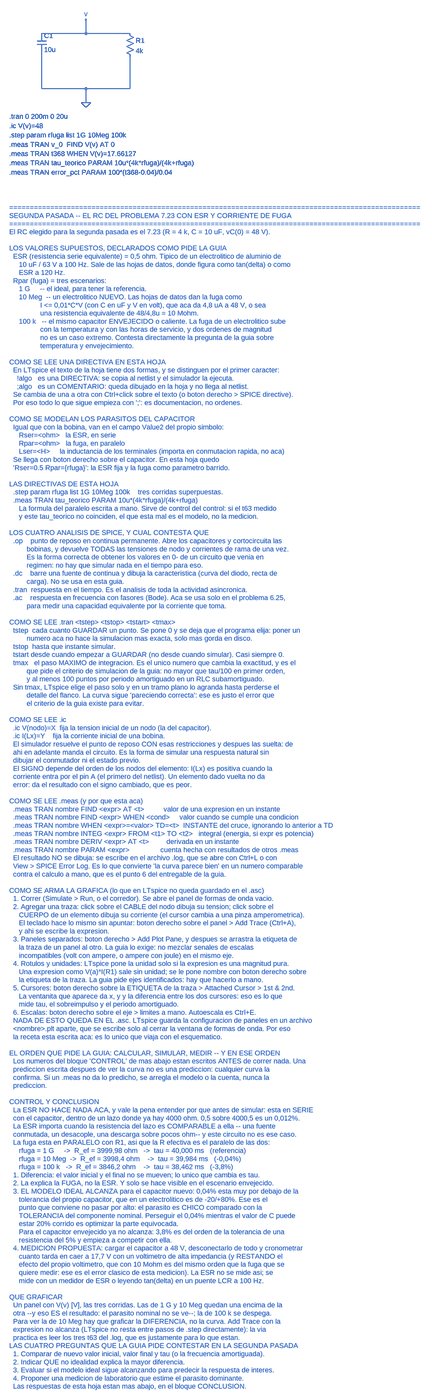
[diagram p0: schematic X2_no_ideal_RC_con_fuga.asc, whole sheet]
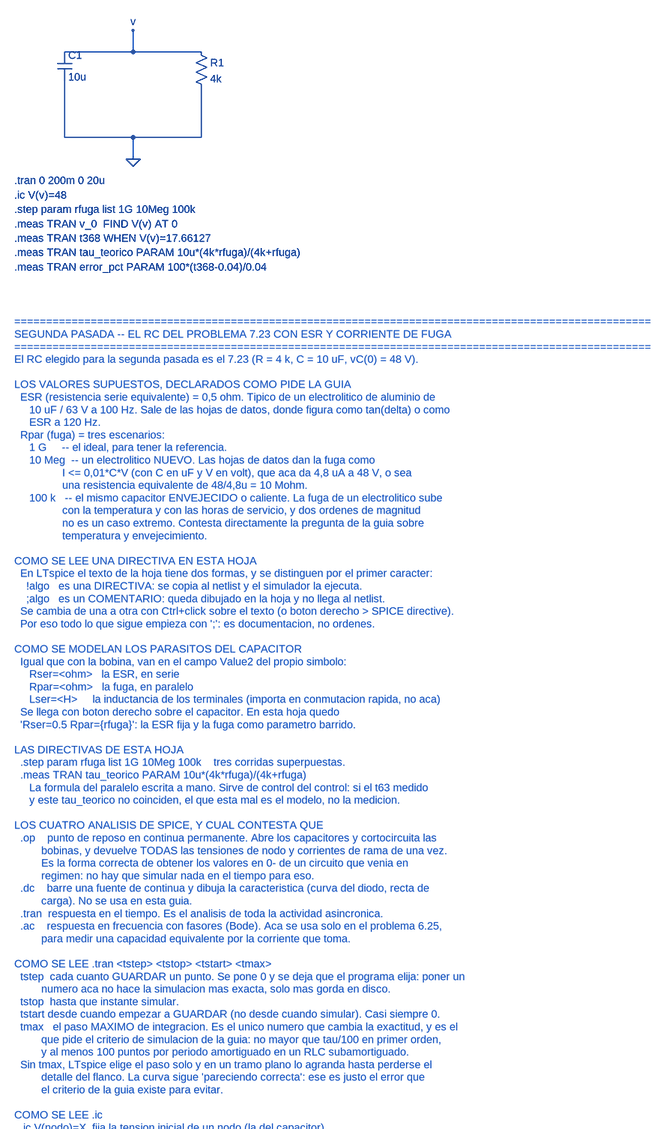
[diagram p1: schematic X2_no_ideal_RC_con_fuga.asc, part, row 1 of 2, column 1 of 1]
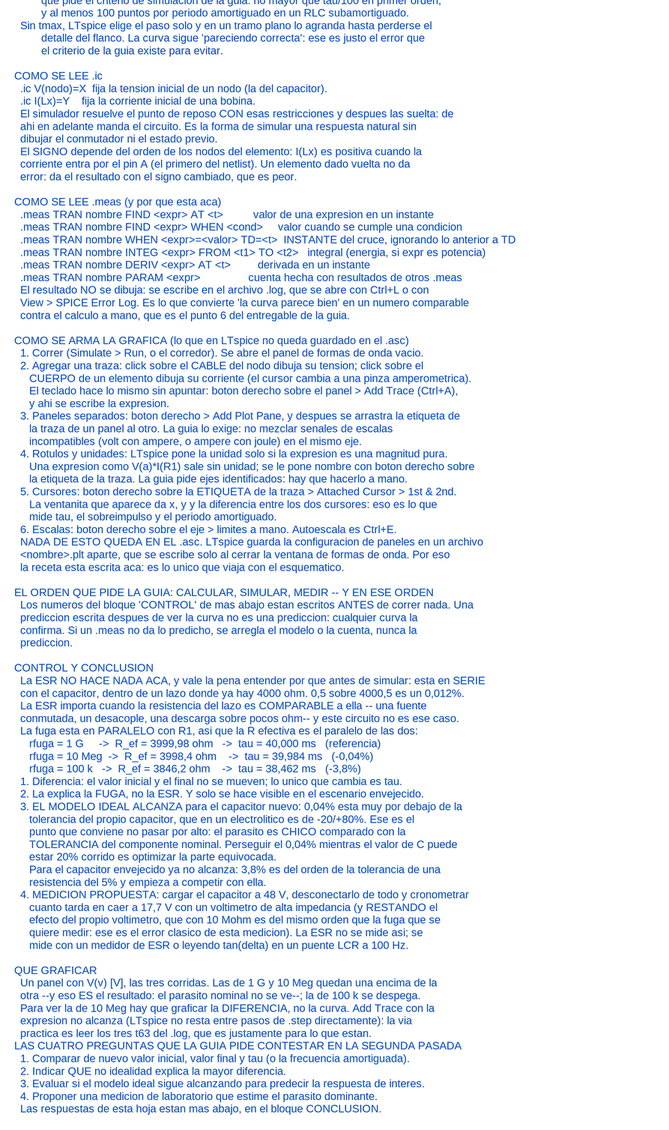
[diagram p2: schematic X2_no_ideal_RC_con_fuga.asc, part, row 2 of 2, column 1 of 1]
X2_no_ideal_RC_con_fuga.asc, the LTspice schematic file:
Version 4
SHEET 1 2200 2800
WIRE 176 176 176 304
WIRE 480 192 480 304
WIRE 176 112 480 112
WIRE 176 304 480 304
WIRE 328 304 328 352
WIRE 328 112 328 64
FLAG 328 352 0
FLAG 328 64 v
SYMBOL cap 160 112 R0
SYMATTR InstName C1
SYMATTR Value 10u
SYMATTR Value2 Rser=0.5 Rpar={rfuga}
SYMBOL res 464 96 R0
SYMATTR InstName R1
SYMATTR Value 4k
TEXT 64 400 Left 2 !.tran 0 200m 0 20u
TEXT 64 432 Left 2 !.ic V(v)=48
TEXT 64 464 Left 2 !.step param rfuga list 1G 10Meg 100k
TEXT 64 496 Left 2 !.meas TRAN v_0  FIND V(v) AT 0
TEXT 64 528 Left 2 !.meas TRAN t368 WHEN V(v)=17.66127
TEXT 64 560 Left 2 !.meas TRAN tau_teorico PARAM 10u*(4k*rfuga)/(4k+rfuga)
TEXT 64 592 Left 2 !.meas TRAN error_pct PARAM 100*(t368-0.04)/0.04
TEXT 64 900 Left 2 ;====================================================================================================
TEXT 64 928 Left 2 ;SEGUNDA PASADA -- EL RC DEL PROBLEMA 7.23 CON ESR Y CORRIENTE DE FUGA
TEXT 64 956 Left 2 ;====================================================================================================
TEXT 64 984 Left 2 ;El RC elegido para la segunda pasada es el 7.23 (R = 4 k, C = 10 uF, vC(0) = 48 V).
TEXT 64 1012 Left 2 ;
TEXT 64 1040 Left 2 ;LOS VALORES SUPUESTOS, DECLARADOS COMO PIDE LA GUIA
TEXT 64 1068 Left 2 ;  ESR (resistencia serie equivalente) = 0,5 ohm. Tipico de un electrolitico de aluminio de
TEXT 64 1096 Left 2 ;     10 uF / 63 V a 100 Hz. Sale de las hojas de datos, donde figura como tan(delta) o como
TEXT 64 1124 Left 2 ;     ESR a 120 Hz.
TEXT 64 1152 Left 2 ;  Rpar (fuga) = tres escenarios:
TEXT 64 1180 Left 2 ;     1 G     -- el ideal, para tener la referencia.
TEXT 64 1208 Left 2 ;     10 Meg  -- un electrolitico NUEVO. Las hojas de datos dan la fuga como
TEXT 64 1236 Left 2 ;                I <= 0,01*C*V (con C en uF y V en volt), que aca da 4,8 uA a 48 V, o sea
TEXT 64 1264 Left 2 ;                una resistencia equivalente de 48/4,8u = 10 Mohm.
TEXT 64 1292 Left 2 ;     100 k   -- el mismo capacitor ENVEJECIDO o caliente. La fuga de un electrolitico sube
TEXT 64 1320 Left 2 ;                con la temperatura y con las horas de servicio, y dos ordenes de magnitud
TEXT 64 1348 Left 2 ;                no es un caso extremo. Contesta directamente la pregunta de la guia sobre
TEXT 64 1376 Left 2 ;                temperatura y envejecimiento.
TEXT 64 1404 Left 2 ;
TEXT 64 1432 Left 2 ;COMO SE LEE UNA DIRECTIVA EN ESTA HOJA
TEXT 64 1460 Left 2 ;  En LTspice el texto de la hoja tiene dos formas, y se distinguen por el primer caracter:
TEXT 64 1488 Left 2 ;    !algo   es una DIRECTIVA: se copia al netlist y el simulador la ejecuta.
TEXT 64 1516 Left 2 ;    ;algo   es un COMENTARIO: queda dibujado en la hoja y no llega al netlist.
TEXT 64 1544 Left 2 ;  Se cambia de una a otra con Ctrl+click sobre el texto (o boton derecho > SPICE directive).
TEXT 64 1572 Left 2 ;  Por eso todo lo que sigue empieza con ';': es documentacion, no ordenes.
TEXT 64 1600 Left 2 ;
TEXT 64 1628 Left 2 ;COMO SE MODELAN LOS PARASITOS DEL CAPACITOR
TEXT 64 1656 Left 2 ;  Igual que con la bobina, van en el campo Value2 del propio simbolo:
TEXT 64 1684 Left 2 ;     Rser=<ohm>   la ESR, en serie
TEXT 64 1712 Left 2 ;     Rpar=<ohm>   la fuga, en paralelo
TEXT 64 1740 Left 2 ;     Lser=<H>     la inductancia de los terminales (importa en conmutacion rapida, no aca)
TEXT 64 1768 Left 2 ;  Se llega con boton derecho sobre el capacitor. En esta hoja quedo
TEXT 64 1796 Left 2 ;  'Rser=0.5 Rpar={rfuga}': la ESR fija y la fuga como parametro barrido.
TEXT 64 1824 Left 2 ;
TEXT 64 1852 Left 2 ;LAS DIRECTIVAS DE ESTA HOJA
TEXT 64 1880 Left 2 ;  .step param rfuga list 1G 10Meg 100k    tres corridas superpuestas.
TEXT 64 1908 Left 2 ;  .meas TRAN tau_teorico PARAM 10u*(4k*rfuga)/(4k+rfuga)
TEXT 64 1936 Left 2 ;     La formula del paralelo escrita a mano. Sirve de control del control: si el t63 medido
TEXT 64 1964 Left 2 ;     y este tau_teorico no coinciden, el que esta mal es el modelo, no la medicion.
TEXT 64 1992 Left 2 ;
TEXT 64 2020 Left 2 ;LOS CUATRO ANALISIS DE SPICE, Y CUAL CONTESTA QUE
TEXT 64 2048 Left 2 ;  .op    punto de reposo en continua permanente. Abre los capacitores y cortocircuita las
TEXT 64 2076 Left 2 ;         bobinas, y devuelve TODAS las tensiones de nodo y corrientes de rama de una vez.
TEXT 64 2104 Left 2 ;         Es la forma correcta de obtener los valores en 0- de un circuito que venia en
TEXT 64 2132 Left 2 ;         regimen: no hay que simular nada en el tiempo para eso.
TEXT 64 2160 Left 2 ;  .dc    barre una fuente de continua y dibuja la caracteristica (curva del diodo, recta de
TEXT 64 2188 Left 2 ;         carga). No se usa en esta guia.
TEXT 64 2216 Left 2 ;  .tran  respuesta en el tiempo. Es el analisis de toda la actividad asincronica.
TEXT 64 2244 Left 2 ;  .ac    respuesta en frecuencia con fasores (Bode). Aca se usa solo en el problema 6.25,
TEXT 64 2272 Left 2 ;         para medir una capacidad equivalente por la corriente que toma.
TEXT 64 2300 Left 2 ;
TEXT 64 2328 Left 2 ;COMO SE LEE .tran <tstep> <tstop> <tstart> <tmax>
TEXT 64 2356 Left 2 ;  tstep  cada cuanto GUARDAR un punto. Se pone 0 y se deja que el programa elija: poner un
TEXT 64 2384 Left 2 ;         numero aca no hace la simulacion mas exacta, solo mas gorda en disco.
TEXT 64 2412 Left 2 ;  tstop  hasta que instante simular.
TEXT 64 2440 Left 2 ;  tstart desde cuando empezar a GUARDAR (no desde cuando simular). Casi siempre 0.
TEXT 64 2468 Left 2 ;  tmax   el paso MAXIMO de integracion. Es el unico numero que cambia la exactitud, y es el
TEXT 64 2496 Left 2 ;         que pide el criterio de simulacion de la guia: no mayor que tau/100 en primer orden,
TEXT 64 2524 Left 2 ;         y al menos 100 puntos por periodo amortiguado en un RLC subamortiguado.
TEXT 64 2552 Left 2 ;  Sin tmax, LTspice elige el paso solo y en un tramo plano lo agranda hasta perderse el
TEXT 64 2580 Left 2 ;         detalle del flanco. La curva sigue 'pareciendo correcta': ese es justo el error que
TEXT 64 2608 Left 2 ;         el criterio de la guia existe para evitar.
TEXT 64 2636 Left 2 ;
TEXT 64 2664 Left 2 ;COMO SE LEE .ic
TEXT 64 2692 Left 2 ;  .ic V(nodo)=X  fija la tension inicial de un nodo (la del capacitor).
TEXT 64 2720 Left 2 ;  .ic I(Lx)=Y    fija la corriente inicial de una bobina.
TEXT 64 2748 Left 2 ;  El simulador resuelve el punto de reposo CON esas restricciones y despues las suelta: de
TEXT 64 2776 Left 2 ;  ahi en adelante manda el circuito. Es la forma de simular una respuesta natural sin
TEXT 64 2804 Left 2 ;  dibujar el conmutador ni el estado previo.
TEXT 64 2832 Left 2 ;  El SIGNO depende del orden de los nodos del elemento: I(Lx) es positiva cuando la
TEXT 64 2860 Left 2 ;  corriente entra por el pin A (el primero del netlist). Un elemento dado vuelta no da
TEXT 64 2888 Left 2 ;  error: da el resultado con el signo cambiado, que es peor.
TEXT 64 2916 Left 2 ;
TEXT 64 2944 Left 2 ;COMO SE LEE .meas (y por que esta aca)
TEXT 64 2972 Left 2 ;  .meas TRAN nombre FIND <expr> AT <t>          valor de una expresion en un instante
TEXT 64 3000 Left 2 ;  .meas TRAN nombre FIND <expr> WHEN <cond>     valor cuando se cumple una condicion
TEXT 64 3028 Left 2 ;  .meas TRAN nombre WHEN <expr>=<valor> TD=<t>  INSTANTE del cruce, ignorando lo anterior a TD
TEXT 64 3056 Left 2 ;  .meas TRAN nombre INTEG <expr> FROM <t1> TO <t2>   integral (energia, si expr es potencia)
TEXT 64 3084 Left 2 ;  .meas TRAN nombre DERIV <expr> AT <t>         derivada en un instante
TEXT 64 3112 Left 2 ;  .meas TRAN nombre PARAM <expr>                cuenta hecha con resultados de otros .meas
TEXT 64 3140 Left 2 ;  El resultado NO se dibuja: se escribe en el archivo .log, que se abre con Ctrl+L o con
TEXT 64 3168 Left 2 ;  View > SPICE Error Log. Es lo que convierte 'la curva parece bien' en un numero comparable
TEXT 64 3196 Left 2 ;  contra el calculo a mano, que es el punto 6 del entregable de la guia.
TEXT 64 3224 Left 2 ;
TEXT 64 3252 Left 2 ;COMO SE ARMA LA GRAFICA (lo que en LTspice no queda guardado en el .asc)
TEXT 64 3280 Left 2 ;  1. Correr (Simulate > Run, o el corredor). Se abre el panel de formas de onda vacio.
TEXT 64 3308 Left 2 ;  2. Agregar una traza: click sobre el CABLE del nodo dibuja su tension; click sobre el
TEXT 64 3336 Left 2 ;     CUERPO de un elemento dibuja su corriente (el cursor cambia a una pinza amperometrica).
TEXT 64 3364 Left 2 ;     El teclado hace lo mismo sin apuntar: boton derecho sobre el panel > Add Trace (Ctrl+A),
TEXT 64 3392 Left 2 ;     y ahi se escribe la expresion.
TEXT 64 3420 Left 2 ;  3. Paneles separados: boton derecho > Add Plot Pane, y despues se arrastra la etiqueta de
TEXT 64 3448 Left 2 ;     la traza de un panel al otro. La guia lo exige: no mezclar senales de escalas
TEXT 64 3476 Left 2 ;     incompatibles (volt con ampere, o ampere con joule) en el mismo eje.
TEXT 64 3504 Left 2 ;  4. Rotulos y unidades: LTspice pone la unidad solo si la expresion es una magnitud pura.
TEXT 64 3532 Left 2 ;     Una expresion como V(a)*I(R1) sale sin unidad; se le pone nombre con boton derecho sobre
TEXT 64 3560 Left 2 ;     la etiqueta de la traza. La guia pide ejes identificados: hay que hacerlo a mano.
TEXT 64 3588 Left 2 ;  5. Cursores: boton derecho sobre la ETIQUETA de la traza > Attached Cursor > 1st & 2nd.
TEXT 64 3616 Left 2 ;     La ventanita que aparece da x, y y la diferencia entre los dos cursores: eso es lo que
TEXT 64 3644 Left 2 ;     mide tau, el sobreimpulso y el periodo amortiguado.
TEXT 64 3672 Left 2 ;  6. Escalas: boton derecho sobre el eje > limites a mano. Autoescala es Ctrl+E.
TEXT 64 3700 Left 2 ;  NADA DE ESTO QUEDA EN EL .asc. LTspice guarda la configuracion de paneles en un archivo
TEXT 64 3728 Left 2 ;  <nombre>.plt aparte, que se escribe solo al cerrar la ventana de formas de onda. Por eso
TEXT 64 3756 Left 2 ;  la receta esta escrita aca: es lo unico que viaja con el esquematico.
TEXT 64 3784 Left 2 ;
TEXT 64 3812 Left 2 ;EL ORDEN QUE PIDE LA GUIA: CALCULAR, SIMULAR, MEDIR -- Y EN ESE ORDEN
TEXT 64 3840 Left 2 ;  Los numeros del bloque 'CONTROL' de mas abajo estan escritos ANTES de correr nada. Una
TEXT 64 3868 Left 2 ;  prediccion escrita despues de ver la curva no es una prediccion: cualquier curva la
TEXT 64 3896 Left 2 ;  confirma. Si un .meas no da lo predicho, se arregla el modelo o la cuenta, nunca la
TEXT 64 3924 Left 2 ;  prediccion.
TEXT 64 3952 Left 2 ;
TEXT 64 3980 Left 2 ;CONTROL Y CONCLUSION
TEXT 64 4008 Left 2 ;  La ESR NO HACE NADA ACA, y vale la pena entender por que antes de simular: esta en SERIE
TEXT 64 4036 Left 2 ;  con el capacitor, dentro de un lazo donde ya hay 4000 ohm. 0,5 sobre 4000,5 es un 0,012%.
TEXT 64 4064 Left 2 ;  La ESR importa cuando la resistencia del lazo es COMPARABLE a ella -- una fuente
TEXT 64 4092 Left 2 ;  conmutada, un desacople, una descarga sobre pocos ohm-- y este circuito no es ese caso.
TEXT 64 4120 Left 2 ;  La fuga esta en PARALELO con R1, asi que la R efectiva es el paralelo de las dos:
TEXT 64 4148 Left 2 ;     rfuga = 1 G     ->  R_ef = 3999,98 ohm   ->  tau = 40,000 ms   (referencia)
TEXT 64 4176 Left 2 ;     rfuga = 10 Meg  ->  R_ef = 3998,4 ohm    ->  tau = 39,984 ms   (-0,04%)
TEXT 64 4204 Left 2 ;     rfuga = 100 k   ->  R_ef = 3846,2 ohm    ->  tau = 38,462 ms   (-3,8%)
TEXT 64 4232 Left 2 ;  1. Diferencia: el valor inicial y el final no se mueven; lo unico que cambia es tau.
TEXT 64 4260 Left 2 ;  2. La explica la FUGA, no la ESR. Y solo se hace visible en el escenario envejecido.
TEXT 64 4288 Left 2 ;  3. EL MODELO IDEAL ALCANZA para el capacitor nuevo: 0,04% esta muy por debajo de la
TEXT 64 4316 Left 2 ;     tolerancia del propio capacitor, que en un electrolitico es de -20/+80%. Ese es el
TEXT 64 4344 Left 2 ;     punto que conviene no pasar por alto: el parasito es CHICO comparado con la
TEXT 64 4372 Left 2 ;     TOLERANCIA del componente nominal. Perseguir el 0,04% mientras el valor de C puede
TEXT 64 4400 Left 2 ;     estar 20% corrido es optimizar la parte equivocada.
TEXT 64 4428 Left 2 ;     Para el capacitor envejecido ya no alcanza: 3,8% es del orden de la tolerancia de una
TEXT 64 4456 Left 2 ;     resistencia del 5% y empieza a competir con ella.
TEXT 64 4484 Left 2 ;  4. MEDICION PROPUESTA: cargar el capacitor a 48 V, desconectarlo de todo y cronometrar
TEXT 64 4512 Left 2 ;     cuanto tarda en caer a 17,7 V con un voltimetro de alta impedancia (y RESTANDO el
TEXT 64 4540 Left 2 ;     efecto del propio voltimetro, que con 10 Mohm es del mismo orden que la fuga que se
TEXT 64 4568 Left 2 ;     quiere medir: ese es el error clasico de esta medicion). La ESR no se mide asi; se
TEXT 64 4596 Left 2 ;     mide con un medidor de ESR o leyendo tan(delta) en un puente LCR a 100 Hz.
TEXT 64 4624 Left 2 ;
TEXT 64 4652 Left 2 ;QUE GRAFICAR
TEXT 64 4680 Left 2 ;  Un panel con V(v) [V], las tres corridas. Las de 1 G y 10 Meg quedan una encima de la
TEXT 64 4708 Left 2 ;  otra --y eso ES el resultado: el parasito nominal no se ve--; la de 100 k se despega.
TEXT 64 4736 Left 2 ;  Para ver la de 10 Meg hay que graficar la DIFERENCIA, no la curva. Add Trace con la
TEXT 64 4764 Left 2 ;  expresion no alcanza (LTspice no resta entre pasos de .step directamente): la via
TEXT 64 4792 Left 2 ;  practica es leer los tres t63 del .log, que es justamente para lo que estan.
TEXT 64 4820 Left 2 ;LAS CUATRO PREGUNTAS QUE LA GUIA PIDE CONTESTAR EN LA SEGUNDA PASADA
TEXT 64 4848 Left 2 ;  1. Comparar de nuevo valor inicial, valor final y tau (o la frecuencia amortiguada).
TEXT 64 4876 Left 2 ;  2. Indicar QUE no idealidad explica la mayor diferencia.
TEXT 64 4904 Left 2 ;  3. Evaluar si el modelo ideal sigue alcanzando para predecir la respuesta de interes.
TEXT 64 4932 Left 2 ;  4. Proponer una medicion de laboratorio que estime el parasito dominante.
TEXT 64 4960 Left 2 ;  Las respuestas de esta hoja estan mas abajo, en el bloque CONCLUSION.

The netlist it stands for:
* X2_no_ideal_RC_con_fuga.asc
C1 v 0 10u Rser=0.5 Rpar={rfuga}
R1 v 0 4k
.tran 0 200m 0 20u
.ic V(v)=48
.step param rfuga list 1G 10Meg 100k
.meas TRAN v_0  FIND V(v) AT 0
.meas TRAN t368 WHEN V(v)=17.66127
.meas TRAN tau_teorico PARAM 10u*(4k*rfuga)/(4k+rfuga)
.meas TRAN error_pct PARAM 100*(t368-0.04)/0.04
* ====================================================================================================
* SEGUNDA PASADA -- EL RC DEL PROBLEMA 7.23 CON ESR Y CORRIENTE DE FUGA
* ====================================================================================================
* El RC elegido para la segunda pasada es el 7.23 (R = 4 k, C = 10 uF, vC(0) = 48 V).
* LOS VALORES SUPUESTOS, DECLARADOS COMO PIDE LA GUIA
*   ESR (resistencia serie equivalente) = 0,5 ohm. Tipico de un electrolitico de aluminio de
*      10 uF / 63 V a 100 Hz. Sale de las hojas de datos, donde figura como tan(delta) o como
*      ESR a 120 Hz.
*   Rpar (fuga) = tres escenarios:
*      1 G     -- el ideal, para tener la referencia.
*      10 Meg  -- un electrolitico NUEVO. Las hojas de datos dan la fuga como
*                 I <= 0,01*C*V (con C en uF y V en volt), que aca da 4,8 uA a 48 V, o sea
*                 una resistencia equivalente de 48/4,8u = 10 Mohm.
*      100 k   -- el mismo capacitor ENVEJECIDO o caliente. La fuga de un electrolitico sube
*                 con la temperatura y con las horas de servicio, y dos ordenes de magnitud
*                 no es un caso extremo. Contesta directamente la pregunta de la guia sobre
*                 temperatura y envejecimiento.
* COMO SE LEE UNA DIRECTIVA EN ESTA HOJA
*   En LTspice el texto de la hoja tiene dos formas, y se distinguen por el primer caracter:
*     !algo   es una DIRECTIVA: se copia al netlist y el simulador la ejecuta.
*     ;algo   es un COMENTARIO: queda dibujado en la hoja y no llega al netlist.
*   Se cambia de una a otra con Ctrl+click sobre el texto (o boton derecho > SPICE directive).
*   Por eso todo lo que sigue empieza con ';': es documentacion, no ordenes.
* COMO SE MODELAN LOS PARASITOS DEL CAPACITOR
*   Igual que con la bobina, van en el campo Value2 del propio simbolo:
*      Rser=<ohm>   la ESR, en serie
*      Rpar=<ohm>   la fuga, en paralelo
*      Lser=<H>     la inductancia de los terminales (importa en conmutacion rapida, no aca)
*   Se llega con boton derecho sobre el capacitor. En esta hoja quedo
*   'Rser=0.5 Rpar={rfuga}': la ESR fija y la fuga como parametro barrido.
* LAS DIRECTIVAS DE ESTA HOJA
*   .step param rfuga list 1G 10Meg 100k    tres corridas superpuestas.
*   .meas TRAN tau_teorico PARAM 10u*(4k*rfuga)/(4k+rfuga)
*      La formula del paralelo escrita a mano. Sirve de control del control: si el t63 medido
*      y este tau_teorico no coinciden, el que esta mal es el modelo, no la medicion.
* LOS CUATRO ANALISIS DE SPICE, Y CUAL CONTESTA QUE
*   .op    punto de reposo en continua permanente. Abre los capacitores y cortocircuita las
*          bobinas, y devuelve TODAS las tensiones de nodo y corrientes de rama de una vez.
*          Es la forma correcta de obtener los valores en 0- de un circuito que venia en
*          regimen: no hay que simular nada en el tiempo para eso.
*   .dc    barre una fuente de continua y dibuja la caracteristica (curva del diodo, recta de
*          carga). No se usa en esta guia.
*   .tran  respuesta en el tiempo. Es el analisis de toda la actividad asincronica.
*   .ac    respuesta en frecuencia con fasores (Bode). Aca se usa solo en el problema 6.25,
*          para medir una capacidad equivalente por la corriente que toma.
* COMO SE LEE .tran <tstep> <tstop> <tstart> <tmax>
*   tstep  cada cuanto GUARDAR un punto. Se pone 0 y se deja que el programa elija: poner un
*          numero aca no hace la simulacion mas exacta, solo mas gorda en disco.
*   tstop  hasta que instante simular.
*   tstart desde cuando empezar a GUARDAR (no desde cuando simular). Casi siempre 0.
*   tmax   el paso MAXIMO de integracion. Es el unico numero que cambia la exactitud, y es el
*          que pide el criterio de simulacion de la guia: no mayor que tau/100 en primer orden,
*          y al menos 100 puntos por periodo amortiguado en un RLC subamortiguado.
*   Sin tmax, LTspice elige el paso solo y en un tramo plano lo agranda hasta perderse el
*          detalle del flanco. La curva sigue 'pareciendo correcta': ese es justo el error que
*          el criterio de la guia existe para evitar.
* COMO SE LEE .ic
*   .ic V(nodo)=X  fija la tension inicial de un nodo (la del capacitor).
*   .ic I(Lx)=Y    fija la corriente inicial de una bobina.
*   El simulador resuelve el punto de reposo CON esas restricciones y despues las suelta: de
*   ahi en adelante manda el circuito. Es la forma de simular una respuesta natural sin
*   dibujar el conmutador ni el estado previo.
*   El SIGNO depende del orden de los nodos del elemento: I(Lx) es positiva cuando la
*   corriente entra por el pin A (el primero del netlist). Un elemento dado vuelta no da
*   error: da el resultado con el signo cambiado, que es peor.
* COMO SE LEE .meas (y por que esta aca)
*   .meas TRAN nombre FIND <expr> AT <t>          valor de una expresion en un instante
*   .meas TRAN nombre FIND <expr> WHEN <cond>     valor cuando se cumple una condicion
*   .meas TRAN nombre WHEN <expr>=<valor> TD=<t>  INSTANTE del cruce, ignorando lo anterior a TD
*   .meas TRAN nombre INTEG <expr> FROM <t1> TO <t2>   integral (energia, si expr es potencia)
*   .meas TRAN nombre DERIV <expr> AT <t>         derivada en un instante
*   .meas TRAN nombre PARAM <expr>                cuenta hecha con resultados de otros .meas
*   El resultado NO se dibuja: se escribe en el archivo .log, que se abre con Ctrl+L o con
*   View > SPICE Error Log. Es lo que convierte 'la curva parece bien' en un numero comparable
*   contra el calculo a mano, que es el punto 6 del entregable de la guia.
* COMO SE ARMA LA GRAFICA (lo que en LTspice no queda guardado en el .asc)
*   1. Correr (Simulate > Run, o el corredor). Se abre el panel de formas de onda vacio.
*   2. Agregar una traza: click sobre el CABLE del nodo dibuja su tension; click sobre el
*      CUERPO de un elemento dibuja su corriente (el cursor cambia a una pinza amperometrica).
*      El teclado hace lo mismo sin apuntar: boton derecho sobre el panel > Add Trace (Ctrl+A),
*      y ahi se escribe la expresion.
*   3. Paneles separados: boton derecho > Add Plot Pane, y despues se arrastra la etiqueta de
*      la traza de un panel al otro. La guia lo exige: no mezclar senales de escalas
*      incompatibles (volt con ampere, o ampere con joule) en el mismo eje.
*   4. Rotulos y unidades: LTspice pone la unidad solo si la expresion es una magnitud pura.
*      Una expresion como V(a)*I(R1) sale sin unidad; se le pone nombre con boton derecho sobre
*      la etiqueta de la traza. La guia pide ejes identificados: hay que hacerlo a mano.
*   5. Cursores: boton derecho sobre la ETIQUETA de la traza > Attached Cursor > 1st & 2nd.
*      La ventanita que aparece da x, y y la diferencia entre los dos cursores: eso es lo que
*      mide tau, el sobreimpulso y el periodo amortiguado.
*   6. Escalas: boton derecho sobre el eje > limites a mano. Autoescala es Ctrl+E.
*   NADA DE ESTO QUEDA EN EL .asc. LTspice guarda la configuracion de paneles en un archivo
*   <nombre>.plt aparte, que se escribe solo al cerrar la ventana de formas de onda. Por eso
*   la receta esta escrita aca: es lo unico que viaja con el esquematico.
* EL ORDEN QUE PIDE LA GUIA: CALCULAR, SIMULAR, MEDIR -- Y EN ESE ORDEN
*   Los numeros del bloque 'CONTROL' de mas abajo estan escritos ANTES de correr nada. Una
*   prediccion escrita despues de ver la curva no es una prediccion: cualquier curva la
*   confirma. Si un .meas no da lo predicho, se arregla el modelo o la cuenta, nunca la
*   prediccion.
* CONTROL Y CONCLUSION
*   La ESR NO HACE NADA ACA, y vale la pena entender por que antes de simular: esta en SERIE
*   con el capacitor, dentro de un lazo donde ya hay 4000 ohm. 0,5 sobre 4000,5 es un 0,012%.
*   La ESR importa cuando la resistencia del lazo es COMPARABLE a ella -- una fuente
*   conmutada, un desacople, una descarga sobre pocos ohm-- y este circuito no es ese caso.
*   La fuga esta en PARALELO con R1, asi que la R efectiva es el paralelo de las dos:
*      rfuga = 1 G     ->  R_ef = 3999,98 ohm   ->  tau = 40,000 ms   (referencia)
*      rfuga = 10 Meg  ->  R_ef = 3998,4 ohm    ->  tau = 39,984 ms   (-0,04%)
*      rfuga = 100 k   ->  R_ef = 3846,2 ohm    ->  tau = 38,462 ms   (-3,8%)
*   1. Diferencia: el valor inicial y el final no se mueven; lo unico que cambia es tau.
*   2. La explica la FUGA, no la ESR. Y solo se hace visible en el escenario envejecido.
*   3. EL MODELO IDEAL ALCANZA para el capacitor nuevo: 0,04% esta muy por debajo de la
*      tolerancia del propio capacitor, que en un electrolitico es de -20/+80%. Ese es el
*      punto que conviene no pasar por alto: el parasito es CHICO comparado con la
*      TOLERANCIA del componente nominal. Perseguir el 0,04% mientras el valor de C puede
*      estar 20% corrido es optimizar la parte equivocada.
*      Para el capacitor envejecido ya no alcanza: 3,8% es del orden de la tolerancia de una
*      resistencia del 5% y empieza a competir con ella.
*   4. MEDICION PROPUESTA: cargar el capacitor a 48 V, desconectarlo de todo y cronometrar
*      cuanto tarda en caer a 17,7 V con un voltimetro de alta impedancia (y RESTANDO el
*      efecto del propio voltimetro, que con 10 Mohm es del mismo orden que la fuga que se
*      quiere medir: ese es el error clasico de esta medicion). La ESR no se mide asi; se
*      mide con un medidor de ESR o leyendo tan(delta) en un puente LCR a 100 Hz.
* QUE GRAFICAR
*   Un panel con V(v) [V], las tres corridas. Las de 1 G y 10 Meg quedan una encima de la
*   otra --y eso ES el resultado: el parasito nominal no se ve--; la de 100 k se despega.
*   Para ver la de 10 Meg hay que graficar la DIFERENCIA, no la curva. Add Trace con la
*   expresion no alcanza (LTspice no resta entre pasos de .step directamente): la via
*   practica es leer los tres t63 del .log, que es justamente para lo que estan.
* LAS CUATRO PREGUNTAS QUE LA GUIA PIDE CONTESTAR EN LA SEGUNDA PASADA
*   1. Comparar de nuevo valor inicial, valor final y tau (o la frecuencia amortiguada).
*   2. Indicar QUE no idealidad explica la mayor diferencia.
*   3. Evaluar si el modelo ideal sigue alcanzando para predecir la respuesta de interes.
*   4. Proponer una medicion de laboratorio que estime el parasito dominante.
*   Las respuestas de esta hoja estan mas abajo, en el bloque CONCLUSION.
.backanno
.end